# Altium schematic sheet STM32.SchDoc
size C; SheetNumber: 1; SheetTotal: 1
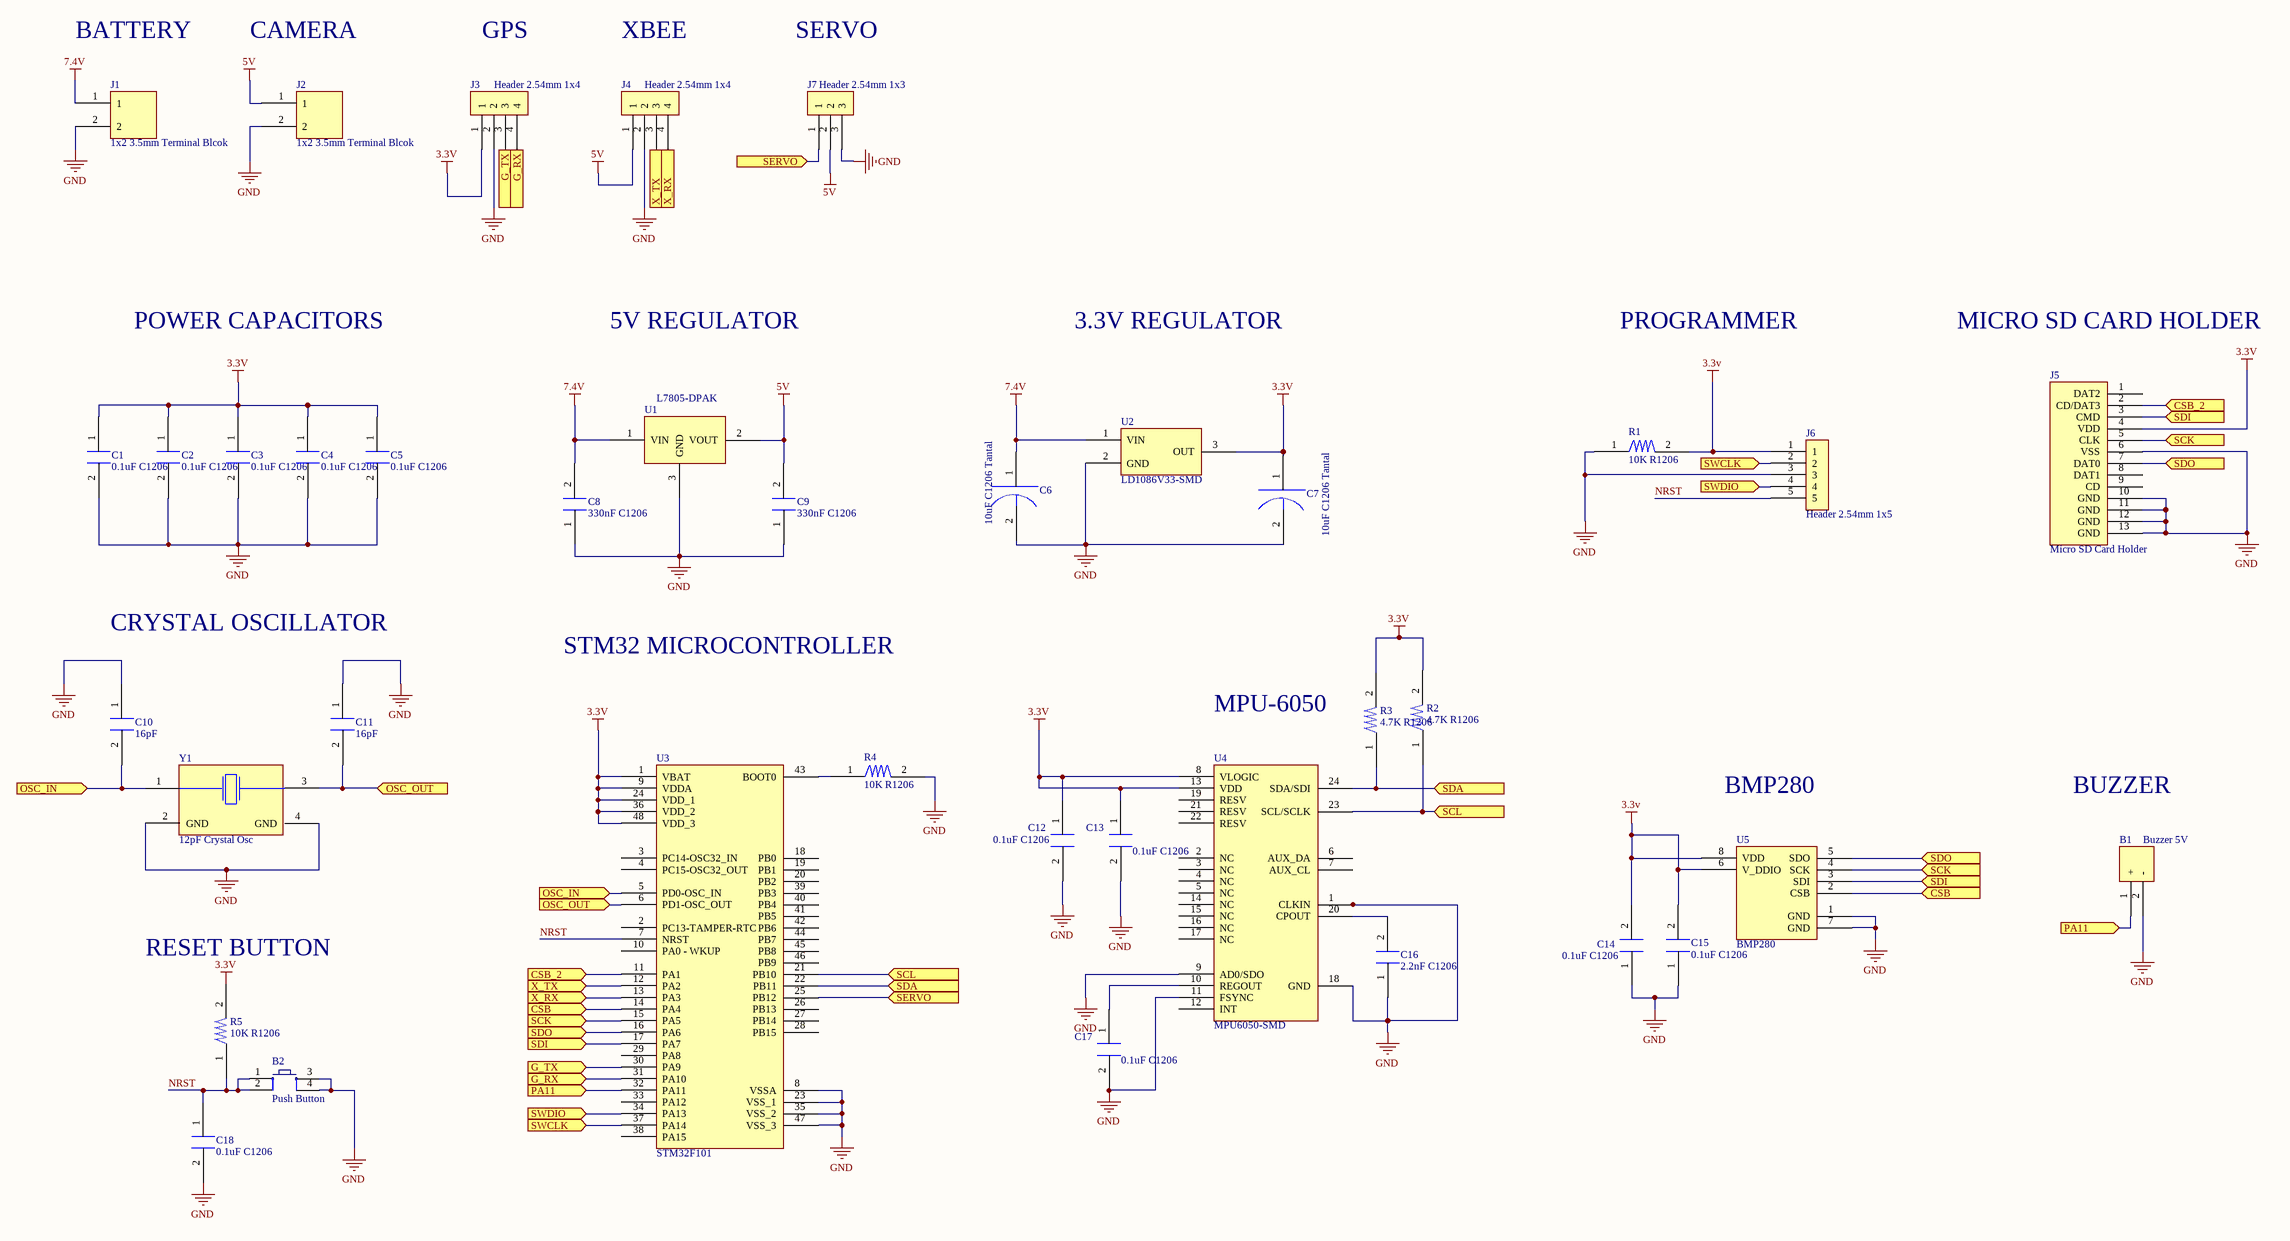
[diagram p0: STM32.SchDoc]

## Parts
B1  Buzzer 5V  [Buzzer 5V]
B2  Push Button  [PUSB BUTTON-SMD]
C1  0.1uF C1206  [C1206]
C2  0.1uF C1206  [C1206]
C3  0.1uF C1206  [C1206]
C4  0.1uF C1206  [C1206]
C5  0.1uF C1206  [C1206]
C6  10uF C1206 Tantal  [C1206 TANTAL 10uF Capacitor]
C7  10uF C1206 Tantal  [C1206 TANTAL 10uF Capacitor]
C8  330nF C1206  [C1206 330nF]
C9  330nF C1206  [C1206 330nF]
C10  16pF  [C1206 Capacitor]
C11  16pF  [C1206 Capacitor]
C12  0.1uF C1206  [C1206 330nF]
C13  0.1uF C1206  [C1206 330nF]
C14  0.1uF C1206  [C1206 330nF]
C15  0.1uF C1206  [C1206 330nF]
C16  2.2nF C1206  [C1206 Capacitor]
C17  0.1uF C1206  [C1206 330nF]
C18  0.1uF C1206  [C1206]
J1  1x2 3.5mm Terminal Blcok  [1x2 3.5mm Terminal Block]
J2  1x2 3.5mm Terminal Blcok  [1x2 3.5mm Terminal Block]
J3  Header 2.54mm 1x4  [HEADER 2.54MM 1X4]
J4  Header 2.54mm 1x4  [HEADER 2.54MM 1X4]
J5  Micro SD Card Holder  [KLS1-TF-003]
J6  Header 2.54mm 1x5  [HEADER 2.54MM 1X5]
J7  Header 2.54mm 1x3  [HEADER 2.54mm 1x3]
R1  10K R1206  [R1206 Resistor]
R2  4.7K R1206  [R1206 Resistor]
R3  4.7K R1206  [R1206 Resistor]
R4  10K R1206  [R1206 Resistor]
R5  10K R1206  [R1206 Resistor]
U1  L7805-DPAK  [L7805-DPAK]
U2  LD1086V33-SMD  [LD108633 3.3V SMD DPAK]
U3  STM32F101  [LQFP48-STM]
U4  MPU6050-SMD  [MPU6050 QFN]
U5  BMP280  [BMP280]
Y1  12pF Crystal Osc  [12pF Crystal Osc.]

## Ports
CSB (in), CSB_2 (in), G_RX (in), G_TX (in), OSC_IN (in), OSC_OUT (in), PA11 (in), SCK (in), SCL (in), SDA (in), SDI (in), SDO (in), SERVO (in), SWCLK (in), SWDIO (in), X_RX (in), X_TX (in)

## Nets
3.3V: C1.1 C2.1 C3.1 C4.1 C5.1 C7.1 C12.1 C13.1 C14.2 C15.2 J3.1 J5.4(VDD) J6.1 R1.2 R2.2 R3.2 R5.2 U2.3(OUT) U3.1(VBAT) U3.9(VDDA) U3.24(VDD_1) U3.36(VDD_2) U3.48(VDD_3) U4.8(VLOGIC) U4.13(VDD) U5.6(V_DDIO) U5.8(VDD)
5V: C9.2 J2.1 J4.1 J7.2 U1.2(VOUT)
7.4V: C6.1 C8.2 J1.1 U1.1(VIN) U2.1(VIN)
GND: B1.2(-) B2.3 B2.4 C1.2 C2.2 C3.2 C4.2 C5.2 C6.2 C7.2 C8.1 C9.1 C10.1 C11.1 C12.2 C13.2 C14.1 C15.1 C16.1 C17.2 C18.2 J1.2 J2.2 J3.2 J4.2 J5.6(VSS) J5.10(GND) J5.11(GND) J5.12(GND) J5.13(GND) J6.3 J7.3 R1.1 R4.2 U1.3(GND) U2.2(GND) U3.8(VSSA) U3.23(VSS_1) U3.35(VSS_2) U3.47(VSS_3) U4.1(CLKIN) U4.9(AD0/SDO) U4.11(FSYNC) U4.18(GND) U5.1(GND) U5.7(GND) Y1.2(GND) Y1.4(GND)
CSB: U3.14(PA4) U5.2(CSB) ; port CSB
CSB_2: J5.2(CD/DAT3) U3.11(PA1) ; port CSB_2
G_RX: J3.4 U3.31(PA10) ; port G_RX
G_TX: J3.3 U3.30(PA9) ; port G_TX
NRST: B2.1 B2.2 C18.1 J6.5 R5.1 U3.7(NRST)
OSC_IN: C10.2 U3.5(PD0-OSC_IN) ; port OSC_IN
OSC_OUT: C11.2 U3.6(PD1-OSC_OUT) ; port OSC_OUT
PA11: B1.1(+) U3.32(PA11) ; port PA11
SCK: J5.5(CLK) U3.15(PA5) U5.4(SCK) ; port SCK
SCL: R2.1 U3.21(PB10) U4.23(SCL/SCLK) ; port SCL
SDA: R3.1 U3.22(PB11) U4.24(SDA/SDI) ; port SDA
SDI: J5.3(CMD) U3.17(PA7) U5.3(SDI) ; port SDI
SDO: J5.7(DAT0) U3.16(PA6) U5.5(SDO) ; port SDO
SERVO: J7.1 U3.25(PB12) ; port SERVO
SWCLK: J6.2 U3.37(PA14) ; port SWCLK
SWDIO: J6.4 U3.34(PA13) ; port SWDIO
X_RX: J4.4 U3.13(PA3) ; port X_RX
X_TX: J4.3 U3.12(PA2) ; port X_TX
NetC16_2: C16.2 U4.20(CPOUT)
NetC17_1: C17.1 U4.10(REGOUT)
NetR4_1: R4.1 U3.43(BOOT0)

Not connected (* = marked no-connect by the designer): J5 1(DAT2) 8(DAT1) 9(CD); U3 2(PC13-TAMPER-RTC) 3(PC14-OSC32_IN) 4(PC15-OSC32_OUT) 10(PA0_-_WKUP) 18(PB0) 19(PB1) 20(PB2) 26(PB13) 27(PB14) 28(PB15) 29(PA8) 33(PA12) 38(PA15) 39(PB3) 40(PB4) 41(PB5) 42(PB6) 44(PB7) 45(PB8) 46(PB9); U4 2(NC) 3(NC) 4(NC) 5(NC) 6(AUX_DA) 7(AUX_CL) 12(INT) 14(NC) 15(NC) 16(NC) 17(NC) 19(RESV) 21(RESV) 22(RESV); Y1 1(0) 3

## Notes on the sheet
- BATTERY
- CAMERA
- GPS
- XBEE
- SERVO
- POWER CAPACITORS
- 5V REGULATOR
- 3.3V REGULATOR
- PROGRAMMER
- MICRO SD CARD HOLDER
- CRYSTAL OSCILLATOR
- STM32 MICROCONTROLLER
- MPU-6050
- BMP280
- BUZZER
- RESET BUTTON

## Library data of the parts
B2 = Push Button: Smd Push Button; Satın Alma Linki: https://urun.n11.com/diger/mini-pushbutton-switch-smd-P227461537?gclid=Cj0KCQjwkoDmBRCcARIsAG3xzl8Y_-jeD7HocNM6lvuZ_rVp83568XPGtNzlPwXWLph8oCRqo0yh87UaApZYEALw_wcB&gclsrc=aw.ds
C1-C5 C12-C15 C17 C18 = 0.1uF C1206: C1206 Capacitor 0.1uF 50V
C6 C7 = 10uF C1206 Tantal Capacitor
C8 C9 = 330nF C1206: 330 nF C1206 Capacitor
C10 C11 = 16pF C1206: 16pF C1206 Capacitor
C16 = 2.2nF C1206: 2.2nF C1206 Capaciitor
J1 J2 = 1x2 3.5mm Terminal Blcok: 1x2 3.5mm Klemens
J5 = Micro SD Card Holder: KLS1-TF-003 MICRO SD CARD
R1 R4 R5 = 10K R1206: 10K R1206 SMD Resistor
R2 R3 = 4.7K R1206: 4.7K R1206 SMD Resistor
U1 = L7805-DPAK: L7805-DPAK 5V REGULATOR SMD 3PIN
U2 = LD1086V33-SMD: LD1086V33-SMD REGULATOR DPAK
U3 = STM32F101: STM32F101 48 PIN MICROPROSESSOR
U4 = MPU6050-SMD: MPU6050-SMD 24PIN
U5 = BMP280: BMP 280 BOSCH PRESSURE SENSOR 8 PIN